# EasyEDA schematic 1-Schematic_sfy1.json
TITLE: The small friendly buoy; REV: 1.0.1; Date: 2022-08-18; Sheet: 1/1; Drawn By: gauteh; Company: Your Company
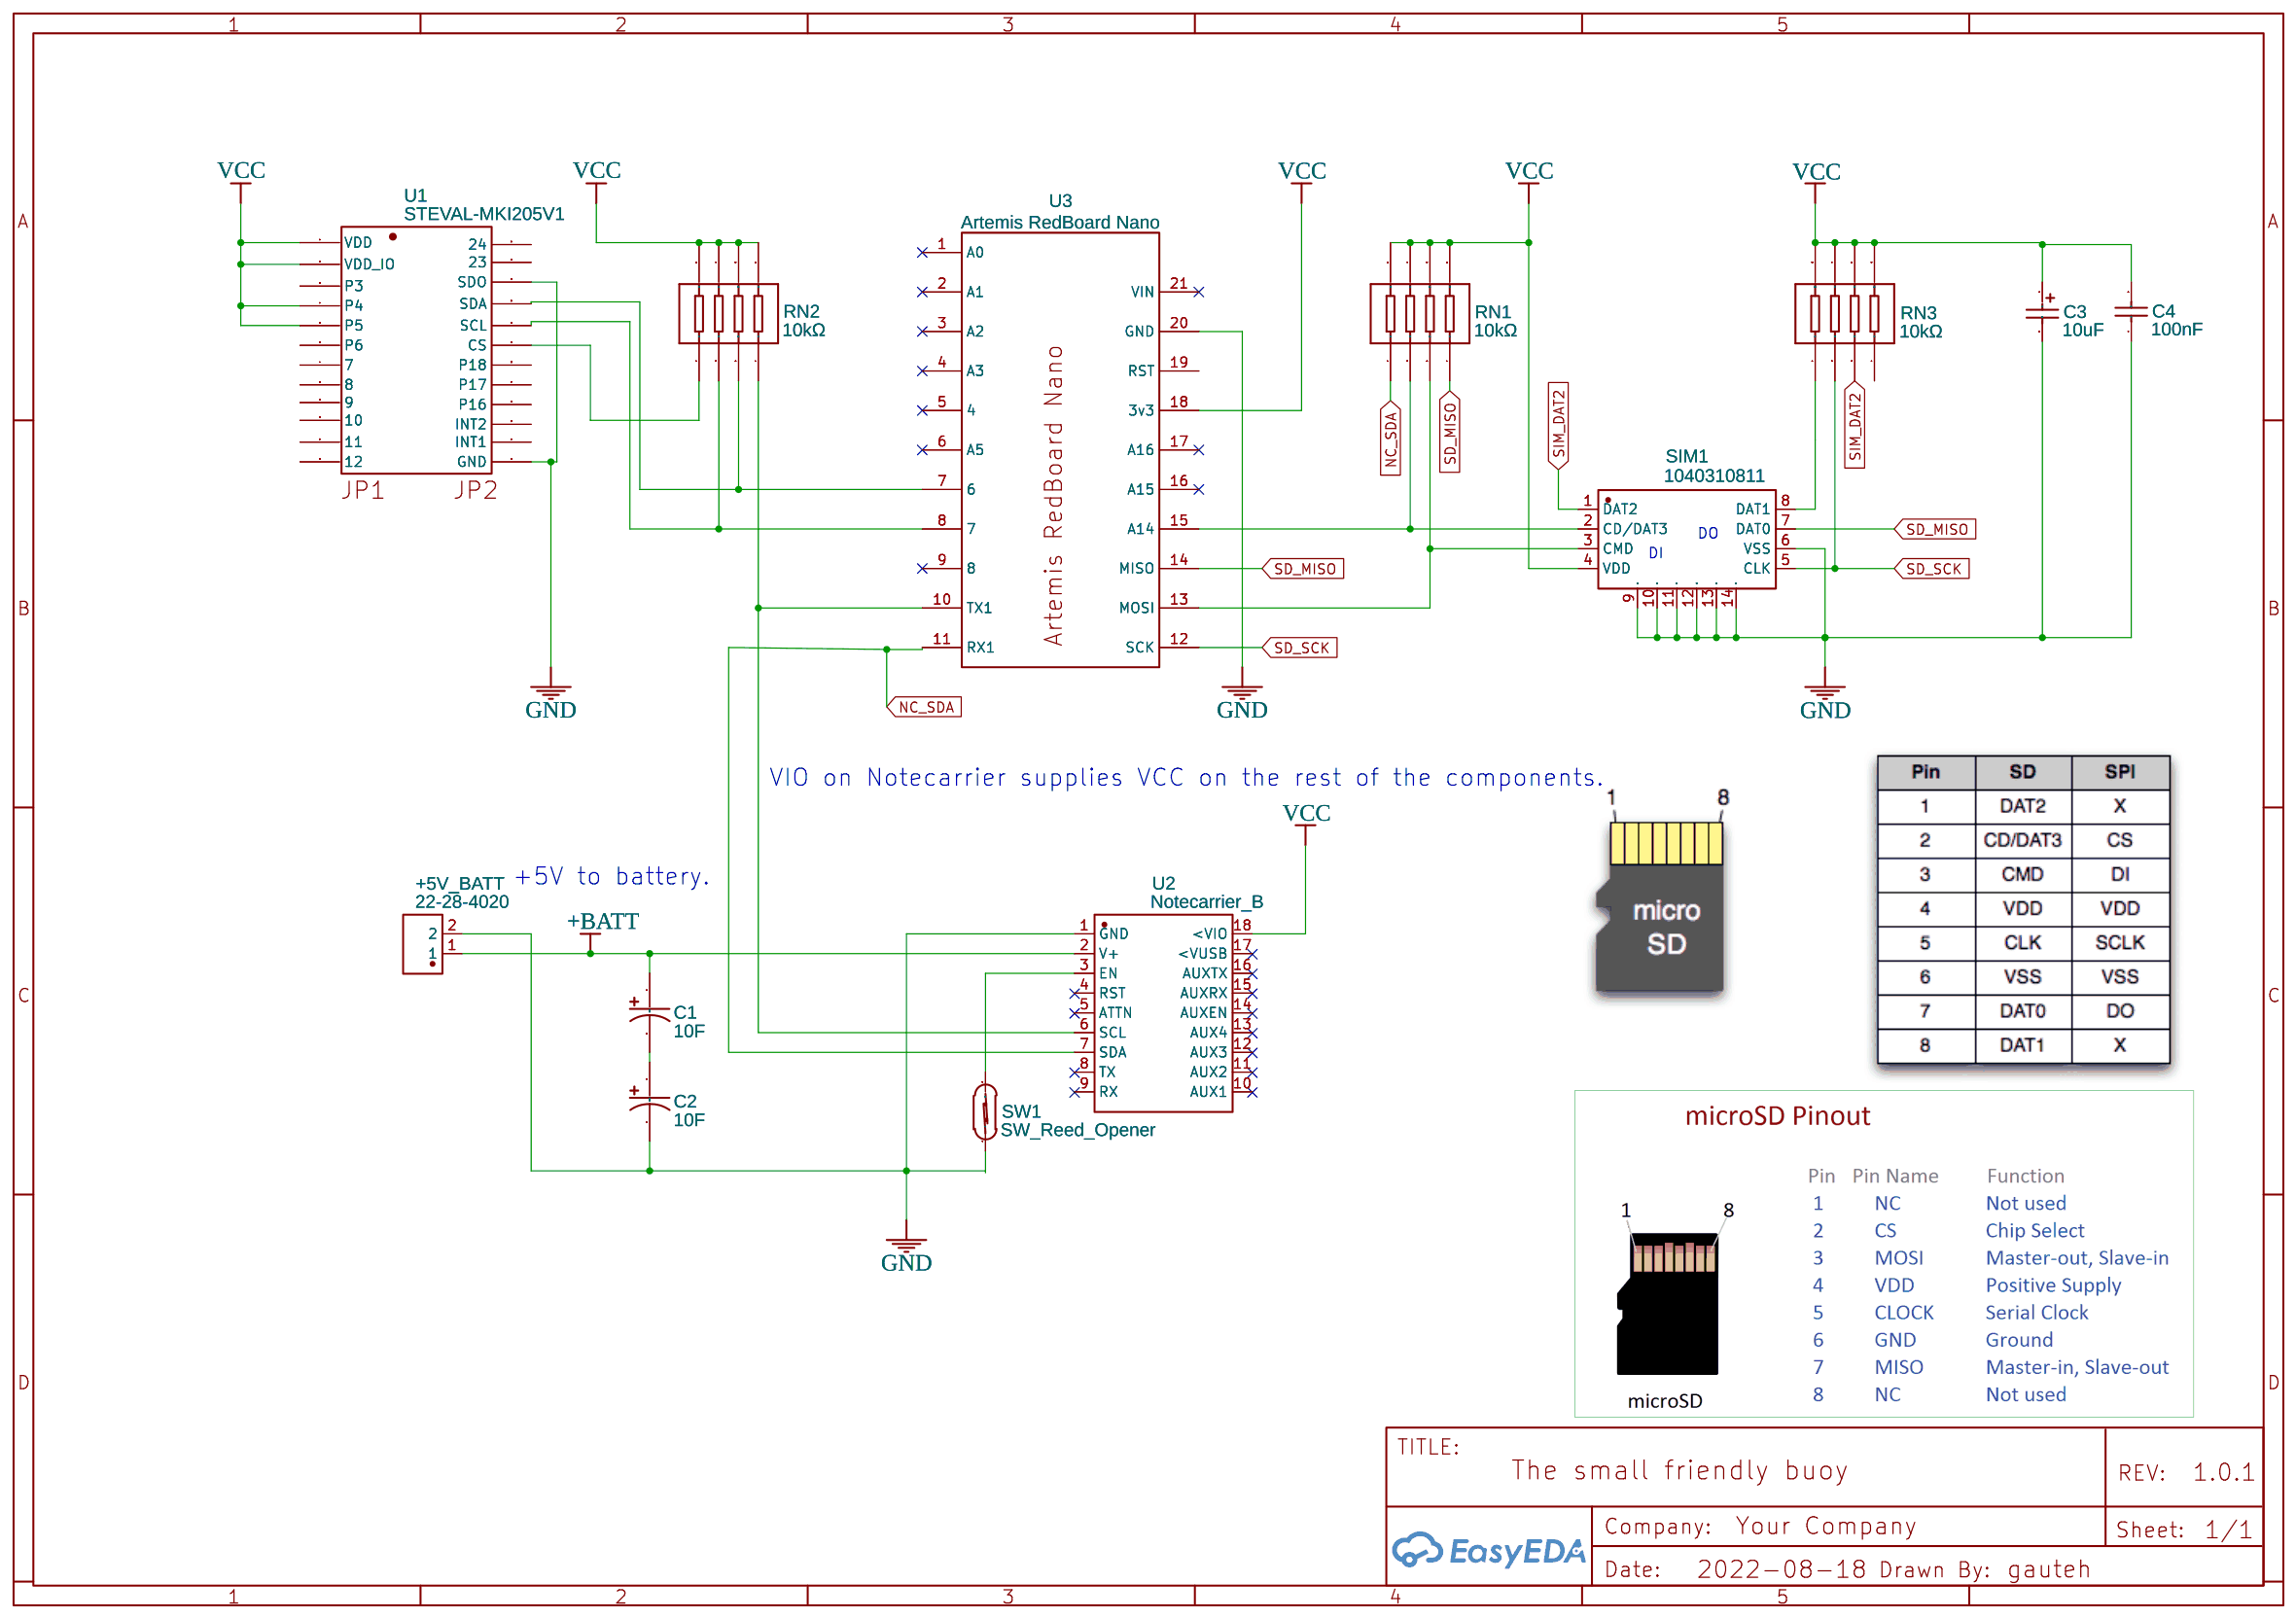
[diagram p0: schematic sheet]

## Parts
+5V_BATT  22-28-4020  [HDR-TH_2P-P2.54-V-M-1]
C1  10F  [CP_12.5X20MM]
C2  10F  [CP_12.5X20MM]
C3  10uF  [CAP-SMD_L3.2-W1.6-RD]
C4  100nF  [C0805]
RN1  10kΩ  [RES-ARRAY-SMD_0603-8P-L3.2-W1.6-BL]
RN2  10kΩ  [RES-ARRAY-SMD_0603-8P-L3.2-W1.6-BL]
RN3  10kΩ  [RES-ARRAY-SMD_0603-8P-L3.2-W1.6-BL]
SIM1  1040310811  [SIM-SMD_8P-1040310811]
SW1  SW_Reed_Opener  [2P]
U1  STEVAL-MKI205V1  [STEVAL-MKI159V1]
U2  Notecarrier_B  [NOTECARRIER_B]
U3  Artemis RedBoard Nano  [ARTEMIS REDBOARD NANO]

## Library data of the parts
+5V_BATT = 22-28-4020: Supplier: LCSC; Supplier Part: C234182; Manufacturer: MOLEX; Contributor: LCSC; JLCPCB Part Class: Extended Part
C1 C2 = SCCT20B106PRB SuperCapacitor 10F 2.7V: Supplier Part: 581-SCCT20B106PRB; Supplier: Mouser; Manufacturer: AVX; Manufacturer Part: SCCT20B106PRB; Contributor: vandabbin; Link: https://www.mouser.com/datasheet/2/40/AVX-SCC-1018831.pdf
C3 = TC212A106M010B: Supplier: LCSC; Manufacturer: Sunlord; Supplier Part: C124849; JLCPCB Part Class: Extended Part
C4 = CC0805KRX7R9BB104: Supplier: LCSC; Manufacturer: YAGEO; Supplier Part: C49678; JLCPCB Part Class: Basic Part
RN1-RN3 = 4D03WGJ0103T5E: Supplier: LCSC; Manufacturer: UniOhm; Supplier Part: C29718; Resistance (Ohms): 10K; JLCPCB Part Class: Basic Part
SIM1 = 1040310811: Supplier: LCSC; Supplier Part: C585350; Manufacturer: MOLEX; Contributor: LCSC; JLCPCB Part Class: Extended Part
SW1 = SW_Reed_Opener: Contributor: KiCAD; license: https://www.gnu.org/licenses/lgpl-2.1.html
U1 = STEVAL-MKI205V1: Contributor: eliranni
U2 = Notecarrier_B: Contributor: LondonBBD
U3 = Artemis RedBoard Nano: Supplier: SparkFun; Contributor: zerblatt007

## Nets
GND: +5V_BATT.2 C2.2 C3.2 C4.1 SIM1.6(VSS) SIM1.9 SIM1.10 SIM1.11 SIM1.12 SIM1.13 SIM1.14 U1.13(GND) U1.22(SDO) U2.1(GND) U3.20(GND)
VCC: C3.1 C4.2 RN1.5 RN1.6 RN1.7 RN1.8 RN2.5 RN2.6 RN2.7 RN2.8 RN3.5 RN3.6 RN3.7 RN3.8 SIM1.4(VDD) U1.1(VDD) U1.2(VDD_IO) U1.4(P4) U1.5(P5) U2.18(<VIO) U3.18(3v3)
+BATT: +5V_BATT.1 C1.1 U2.2(V+)
NC_SDA: RN1.1 U2.7(SDA) U3.11(RX1)
SD_MISO: RN1.4 SIM1.7(DAT0) U3.14(MISO)
SD_SCK: RN3.2 SIM1.5(CLK) U3.12(SCK)
SIM_DAT2: RN3.3 SIM1.1(DAT2)
Net-(C1-2): C1.2 C2.1
Net-(RN1-2): RN1.2 SIM1.2(CD/DAT3) U3.15(A14)
Net-(RN1-3): RN1.3 SIM1.3(CMD) U3.13(MOSI)
Net-(RN2-1): RN2.1 U1.19(CS)
Net-(RN2-2): RN2.2 U1.20(SCL) U3.8(7)
Net-(RN2-3): RN2.3 U1.21(SDA) U3.7(6)
Net-(RN2-4): RN2.4 U2.6(SCL) U3.10(TX1)
Net-(RN3-1): RN3.1 SIM1.8(DAT1)
Net-(SW1-2): SW1.2 U2.3(EN)

Not connected (* = marked no-connect by the designer): RN3 4; SW1 1; U1 3(P3) 6(P6) 7 8 9 10 11 12 14(INT1) 15(INT2) 16(P16) 17(P17) 18(P18) 23 24; U2 4(RST) 5(ATTN) 8(TX) 9(RX) 10(AUX1) 11(AUX2) 12(AUX3) 13(AUX4) 14(AUXEN) 15(AUXRX) 16(AUXTX) 17(<VUSB); U3 1(A0)* 2(A1)* 3(A2)* 4(A3)* 5(4)* 6(A5)* 9(8)* 16(A15)* 17(A16)* 19(RST) 21(VIN)*

## Notes on the sheet
- DO
- DI
- VIO on Notecarrier supplies VCC on the rest of the components.
- +5V to battery.
